# EasyEDA schematic KegWasher_12V_Abort_Filter_1.0_Schematic.EasyEDA.json
TITLE: Keg Washer 12V Abort Filter; REV: 1.0; Date: 2020-05-07; Sheet: 1/1; Drawn By: Kyle Hultman; Company: Kyle Hultman
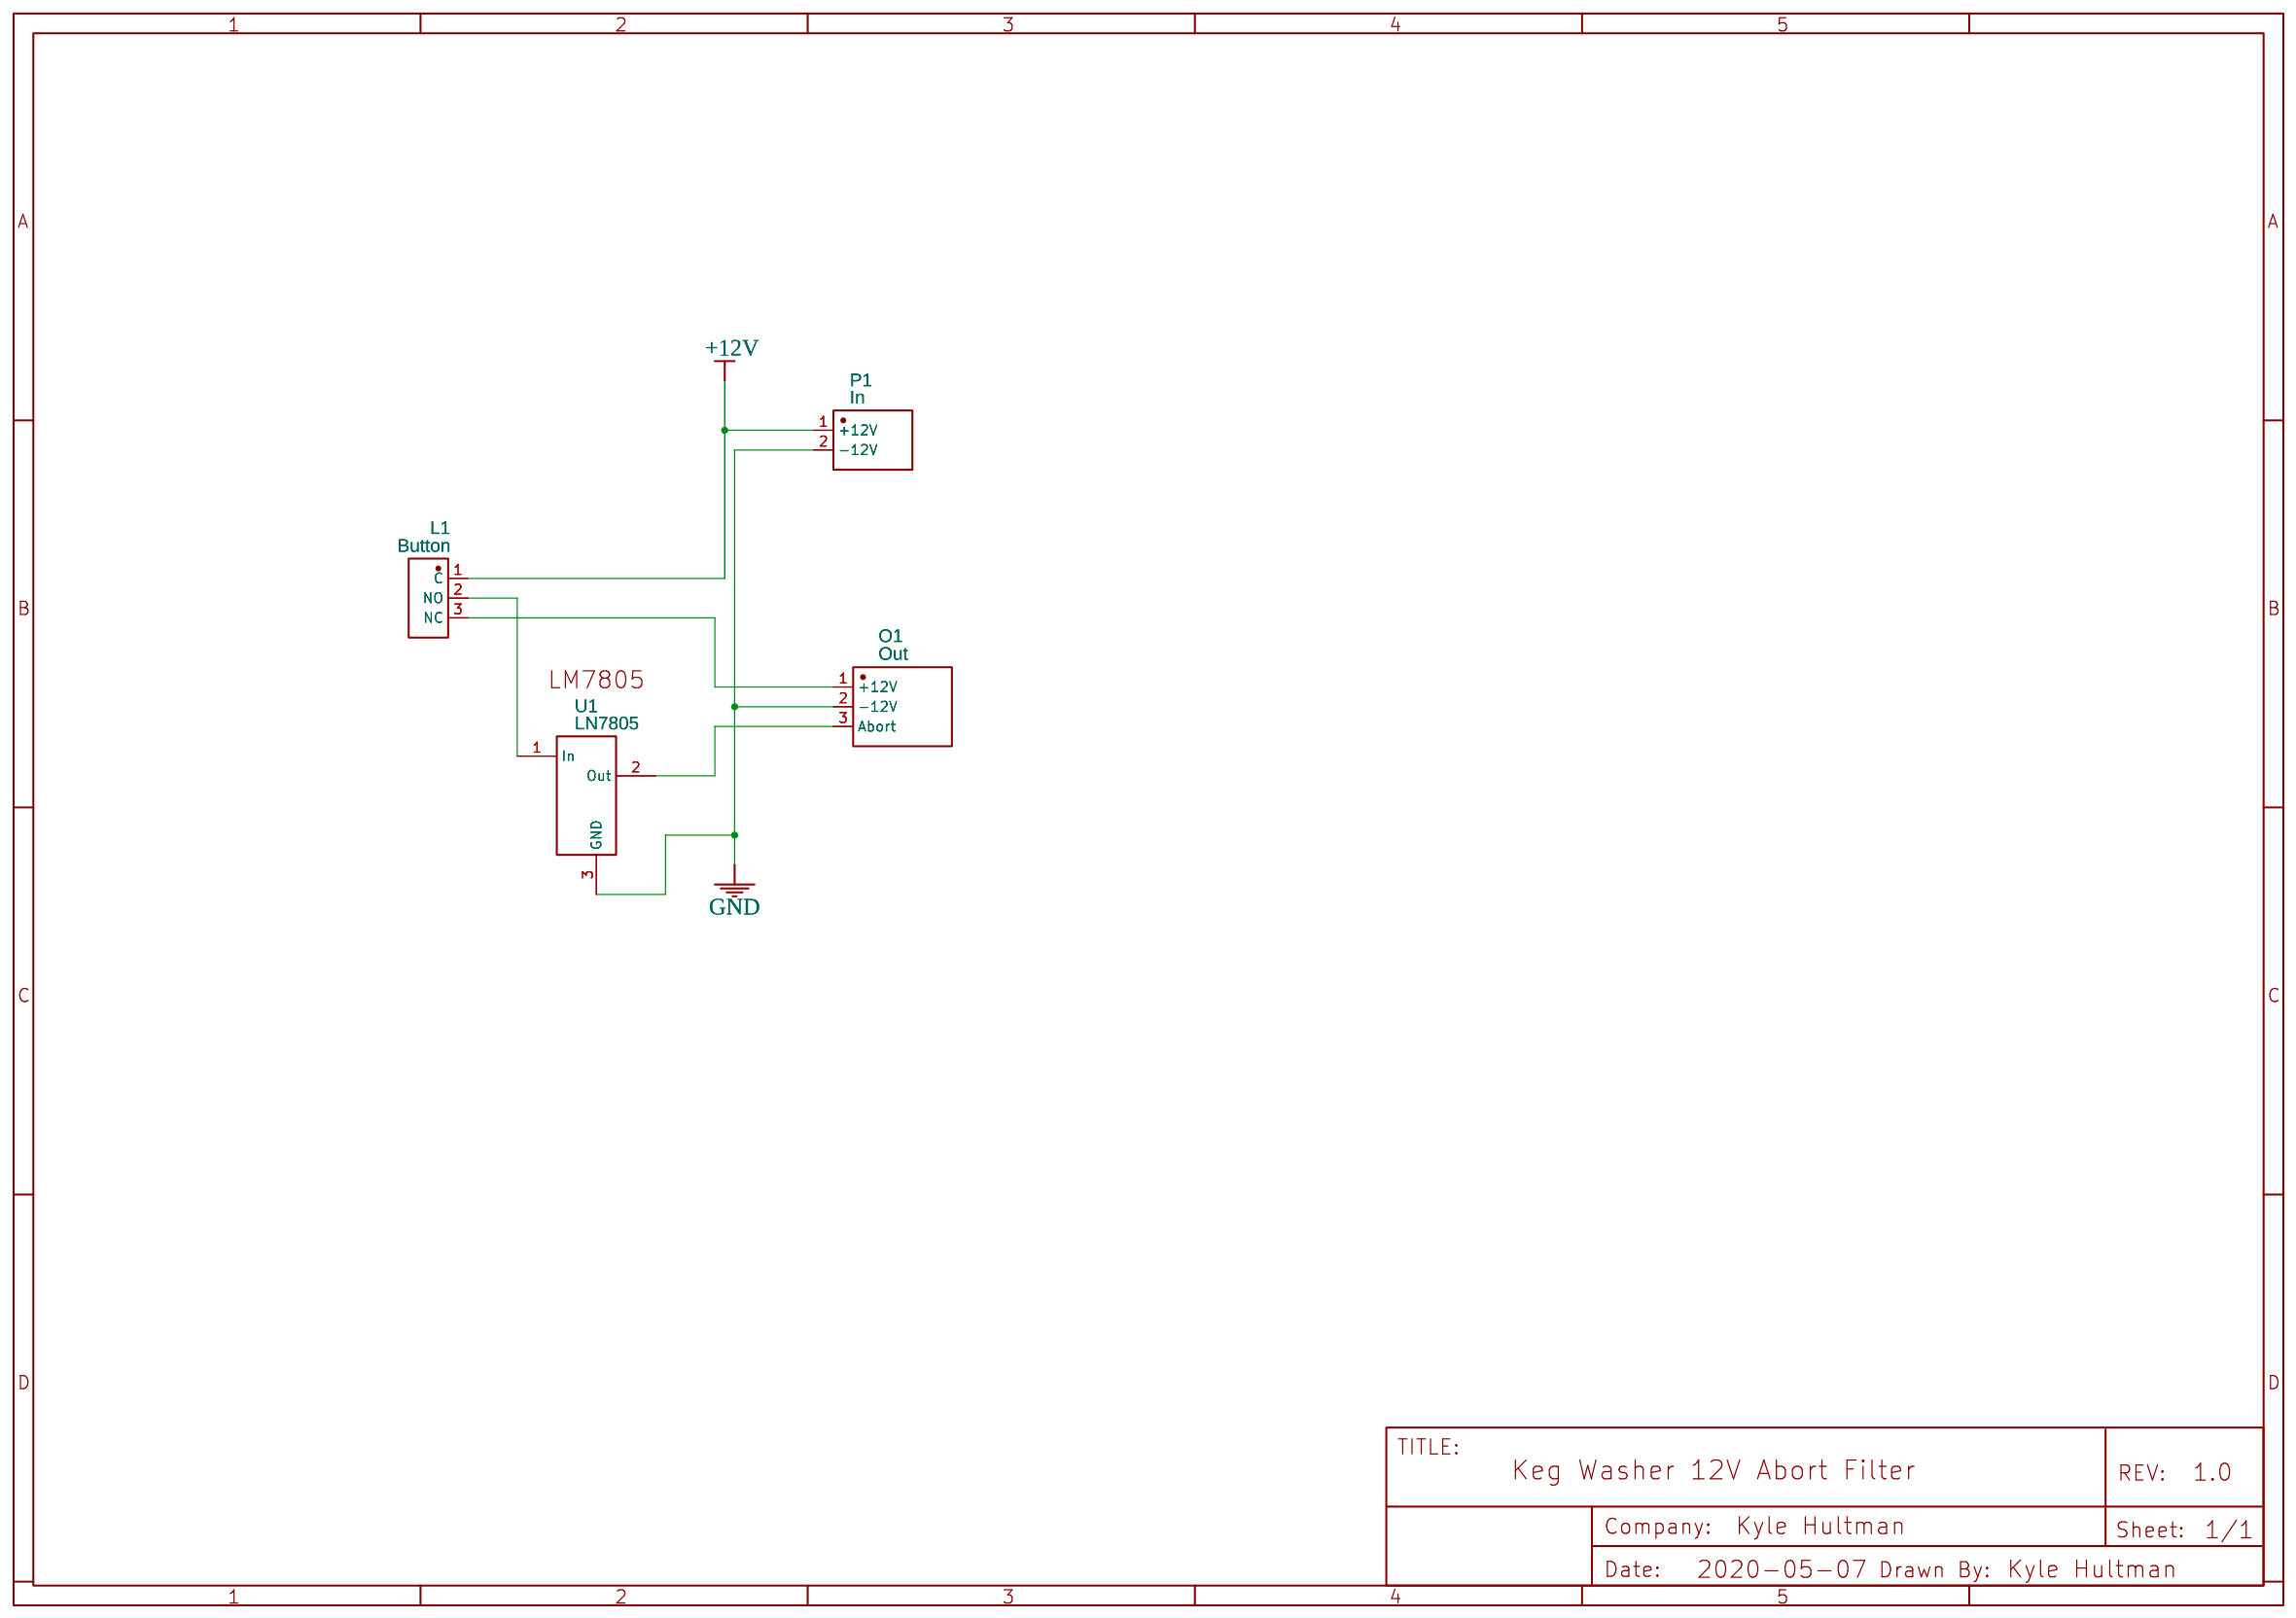
[diagram p0: schematic sheet]

## Parts
L1  Button  [HDR-M-2.54_1X3]
O1  Out  [HDR-M-2.54_1X3]
P1  In  [HDR-M-2.54_1X2]
U1  LN7805  [LM7805]

## Library data of the parts
L1 = Button
O1 = Out
P1 = In
U1 = LN7805: Manufacturer Part: Pollin; Contributor: IraschkoC; Supplier: Iraschko

## Nets
+12V: L1.1(C) P1.1(+12V)
GND: O1.2(-12V) P1.2(-12V) U1.3(GND)
Net-(L1-2): L1.2(NO) U1.1(In)
Net-(L1-3): L1.3(NC) O1.1(+12V)
Net-(O1-3): O1.3(Abort) U1.2(Out)
